# EAGLE design untitled (EAGLE 6.2)
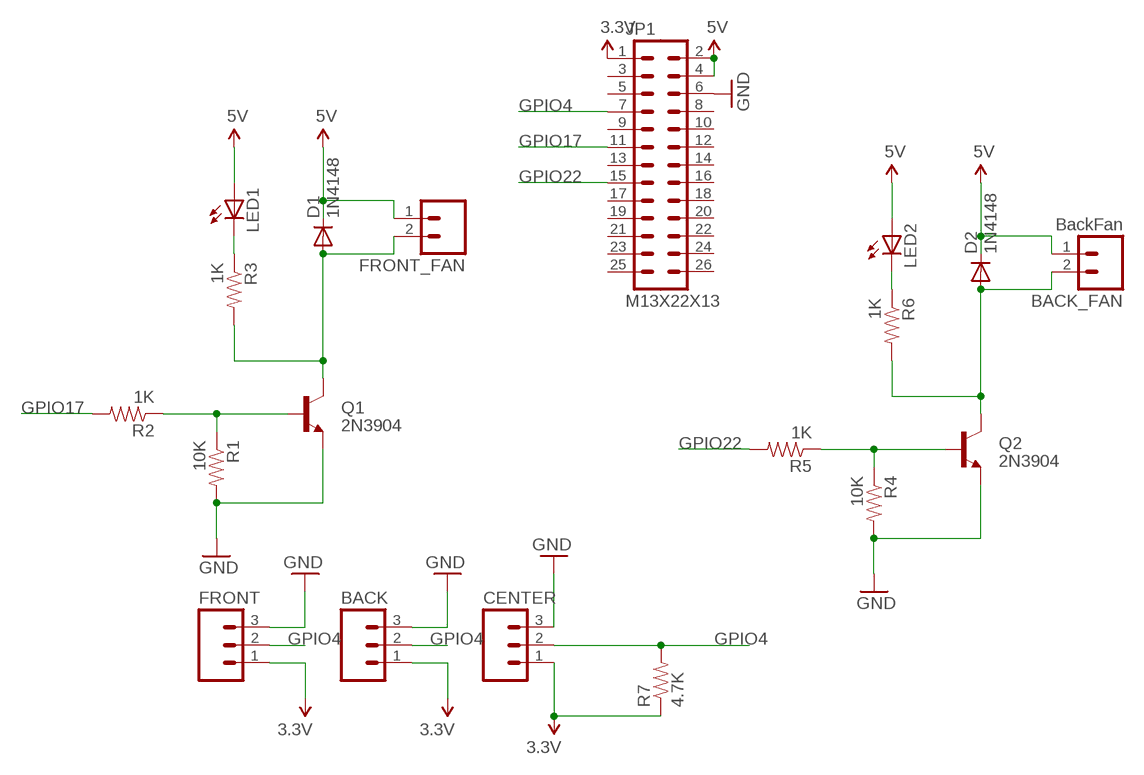
[diagram p0: schematic, sheet 1]

## Parts
BACK  M03LOCK_LONGPADS  [1X03_LOCK_LONGPADS]
BACK_FAN  BackFan  M02LOCK_LONGPADS  [1X02_LOCK_LONGPADS]
CENTER  M03LOCK_LONGPADS  [1X03_LOCK_LONGPADS]
D1  1N4148  DIODE1N4148  [DIODE-1N4148]
D2  1N4148  DIODE1N4148  [DIODE-1N4148]
FRONT  M03LOCK_LONGPADS  [1X03_LOCK_LONGPADS]
FRONT_FAN  M02LOCK_LONGPADS  [1X02_LOCK_LONGPADS]
JP1  M13X22X13  [2X13]
LED1  LED5MM  [LED5MM]
LED2  LED5MM  [LED5MM]
Q1  2N3904  TRANSISTOR_NPNTO92  [TO-92]
Q2  2N3904  TRANSISTOR_NPNTO92  [TO-92]
R1  10K  RESISTOR0805-RES  [0805]
R2  1K  RESISTOR0805-RES  [0805]
R3  1K  RESISTOR0805-RES  [0805]
R4  10K  RESISTOR0805-RES  [0805]
R5  1K  RESISTOR0805-RES  [0805]
R6  1K  RESISTOR0805-RES  [0805]
R7  4.7K  RESISTOR0805-RES  [0805]

## Nets
3.3V: BACK.1 CENTER.1 FRONT.1 JP1.1 R7.1
5V: BACK_FAN.1 D1.C D2.C FRONT_FAN.1 JP1.2 JP1.4 LED1.A LED2.A
GND: BACK.3 CENTER.3 FRONT.3 JP1.6 Q1.1(E) Q2.1(E) R1.2 R4.2
GPIO4: BACK.2 CENTER.2 FRONT.2 JP1.7 R7.2
GPIO17: JP1.11 R2.2
GPIO22: JP1.15 R5.2
N$1: LED1.K(C) R3.1
N$2: Q1.2(B) R1.1 R2.1
N$3: D1.A FRONT_FAN.2 Q1.3(C) R3.2
N$7: LED2.K(C) R6.1
N$8: Q2.2(B) R4.1 R5.1
N$9: BACK_FAN.2 D2.A Q2.3(C) R6.2
Unconnected: JP1.3 JP1.5 JP1.8 JP1.9 JP1.10 JP1.12 JP1.13 JP1.14 JP1.16 JP1.17 JP1.18 JP1.19 JP1.20 JP1.21 JP1.22 JP1.23 JP1.24 JP1.25 JP1.26

## Library data of the parts
BACK CENTER FRONT = SparkFun-Connectors:M03: Header 3 Standard 3-pin 0.1" header. Use with straight break away headers (SKU : PRT-00116), right angle break away headers (PRT-00553), swiss pins (PRT-00743), machine pins (PRT-00117), and female headers (PRT-00115). Molex polarized connector foot print use with SKU : PRT-08232 with associated crimp pins and housings.
BACK_FAN FRONT_FAN = SparkFun-Connectors:M02: Header 2 Standard 2-pin 0.1" header. Use with straight break away headers (SKU : PRT-00116), right angle break away headers (PRT-00553), swiss pins (PRT-00743), machine pins (PRT-00117), and female headers (PRT-00115). Molex polarized connector foot print use with SKU : PRT-08233 with associated crimp pins and housings.
D1 D2 = SparkFun-DiscreteSemi:DIODE: Diode These are standard reverse protection diodes and small signal diodes. SMA package can handle up to about 1A. SOD-323 can handle about 200mA. What the SOD-323 package when ordering, there are some mfgs out there that are 5-pin packages.
JP1 = SparkFun-Connectors:M13X2: 0.1" spaced headers
LED1 LED2 = SparkFun-LED:LED: LEDs Standard schematic elements and footprints for 5mm, 3mm, 1206, and 0603 sized LEDs. 5mm - Spark Fun Electronics SKU : COM-00529 (and others)
Q1 Q2 = SparkFun-DiscreteSemi:TRANSISTOR_NPN: Generic NPN BJT. MMBT2222 is the common NPN we use. Double check against datasheet- not all devices are the same!
R1-R7 = SparkFun-Resistors:RESISTOR: Resistor Basic schematic elements and footprints for 0603, 1206, and PTH resistors.

## Board
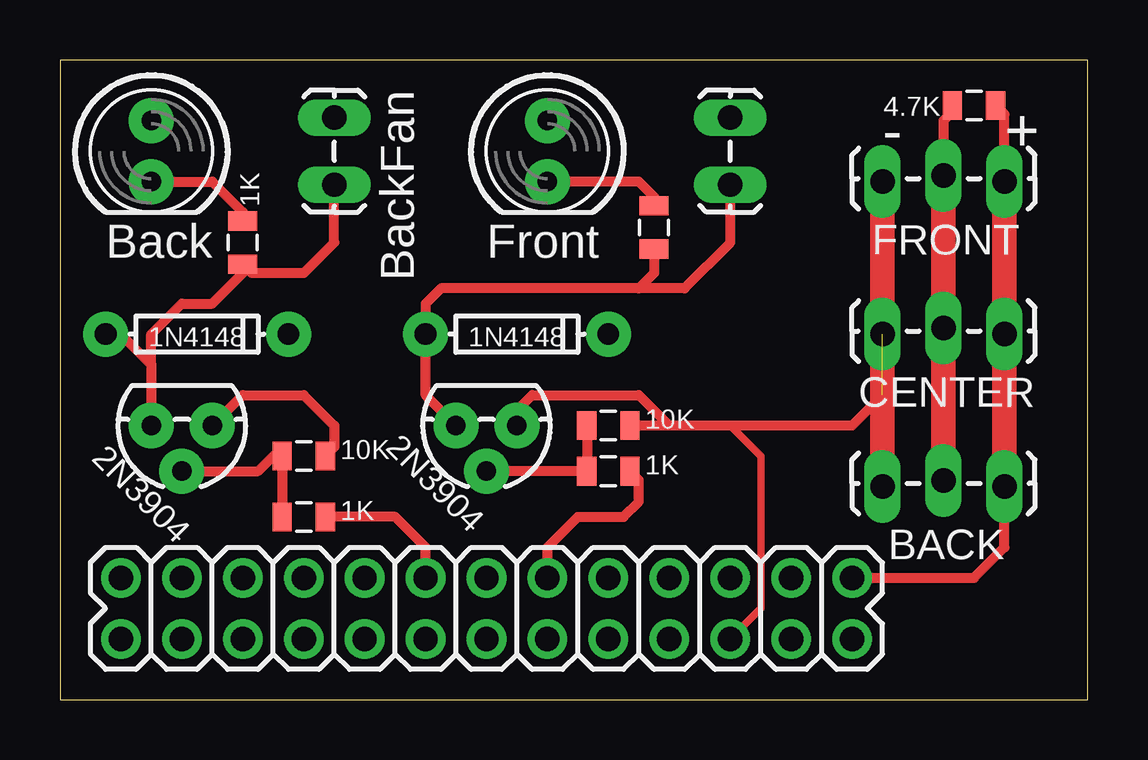
[diagram p1: board, top side]
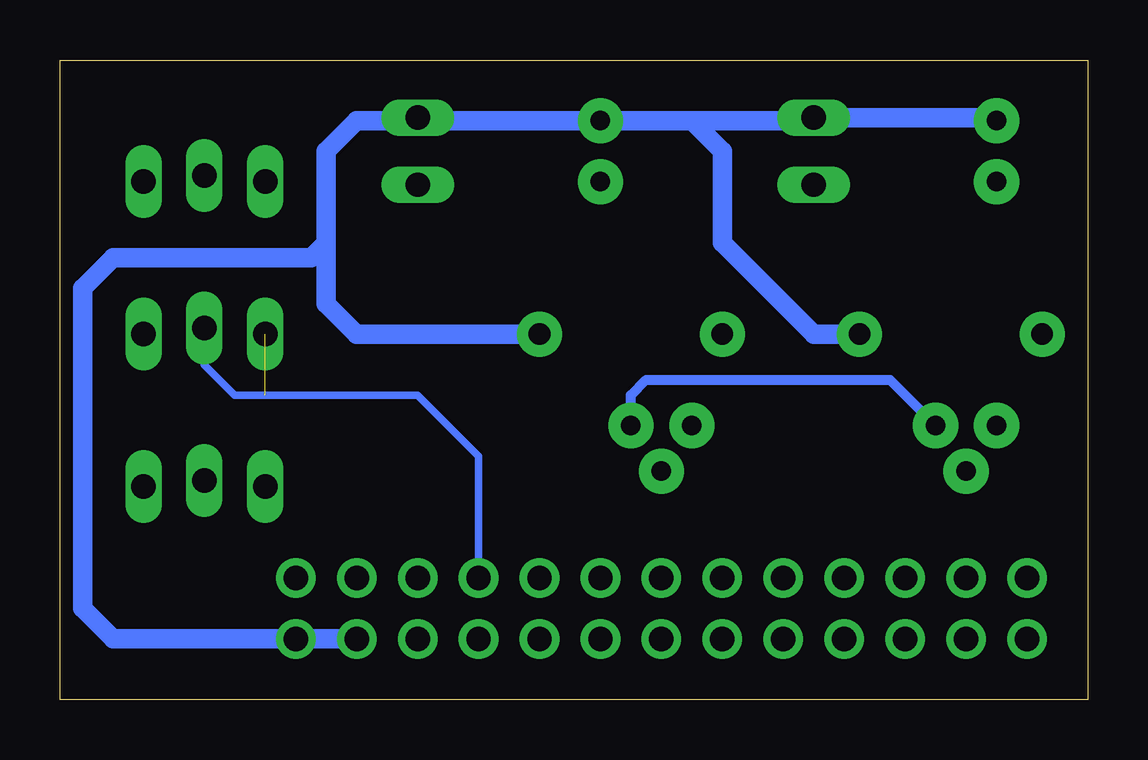
[diagram p2: board, bottom side, seen from below]

Size 42.85 x 26.66 mm. Coordinates in mm from the lower left corner, seen from the top.
Outline: 0,0 42.85,0 42.85,26.66 0,26.66 0,0
Copper layers (1*16): Top 0.0356mm / dielectric 1.5011mm / Bottom 0.0356mm
Design rules "default": minimum track width 6mil, minimum drill 13mil, track to track 6mil, track to pad 6mil, pad to pad 6mil, via to via 6mil, smd to smd 6mil, copper to edge 15mil, drill to drill 6mil, minimum pad ring 7mil, minimum via ring 7mil, stop-mask expansion 4mil, vias tented up to drill 0mil, thermal gap 10mil

### Footprints (pad centres in the part's own frame; a part is rotated, then mirrored left to right if it is on the bottom)
1X03_LOCK_LONGPADS = drill 1.016 long: 1 0,0; 2 2.54,-0.254; 3 5.08,0
1X02_LOCK_LONGPADS = drill 1.016 long: 1 -0.127,0; 2 2.667,0
DIODE-1N4148 = drill 0.9 pad 1.88: A -3.81,0; C 3.81,0
2X13 = drill 1.016 pad 1.651: 1 0,0; 2 0,2.54; 3 2.54,0; 4 2.54,2.54; 5 5.08,0; 6 5.08,2.54; 7 7.62,0; 8 7.62,2.54; 9 10.16,0; 10 10.16,2.54; 11 12.7,0; 12 12.7,2.54; 13 15.24,0; 14 15.24,2.54; 15 17.78,0; 16 17.78,2.54; 17 20.32,0; 18 20.32,2.54; 19 22.86,0; 20 22.86,2.54; 21 25.4,0; 22 25.4,2.54; 23 27.94,0; 24 27.94,2.54; 25 30.48,0; 26 30.48,2.54
LED5MM = drill 0.813 pad 1.88: A -1.27,0; K 1.27,0
TO-92 = drill 0.813 pad 1.88: 1 -1.27,0; 2 0,1.905; 3 1.27,0
0805 = smd 0.8 x 1.2: 1 -0.9,0; 2 0.9,0

### Placement (x,y rotation side)
BACK  39.37,15.24 180 top
BACK_FAN  11.43,24.13 270 top
CENTER  39.37,21.59 180 top
D1  19.05,15.24 0 top
D2  5.71,15.24 0 top
FRONT  39.37,8.89 180 top
FRONT_FAN  27.94,24.13 270 top
JP1  33.02,5.08 180 top
LED1  20.32,22.86 270 top
LED2  3.81,22.86 270 top
Q1  17.78,11.43 180 top
Q2  5.08,11.43 180 top
R1  22.86,11.43 0 top
R2  22.86,9.53 0 top
R3  24.77,19.68 270 top
R4  10.16,10.16 0 top
R5  10.16,7.62 0 top
R6  7.62,19.05 270 top
R7  38.1,24.77 180 top

### Tracks (layer width: path | path; a pad name or v marks a point on that pad's centre or on a via)
3.3V
  Top 0.406: JP1.1 38.1,5.08 39.37,6.35 FRONT.1 | CENTER.1 39.37,24.39 R7.1
  Top 1.016: FRONT.1 BACK.1 CENTER.1
5V
  Bottom 0.813: 16.51,24.13 LED1.A 27.81,24.13 FRONT_FAN.1 28.07,24.13 30.48,24.13 31.75,22.86 31.75,19.05 | 16.51,24.13 11.56,24.13 BACK_FAN.1 3.94,24.26 LED2.A | D2.C 11.43,15.24 15.24,19.05 15.24,22.86 16.51,24.13 | D1.C 30.48,15.24 31.75,16.51 31.75,19.05 | JP1.2 JP1.4 40.64,2.54 41.91,3.81 41.91,17.14 40.64,18.41 32.38,18.41 31.75,19.05
GND  (1 unrouted)
  Top 0.305: JP1.6 29.21,3.81 29.21,10.16 27.94,11.43
  Top 0.406: Q2.1 7.62,12.7 10.16,12.7 11.43,11.43 11.43,10.53 R4.2 | 34.29,12.7 33.02,11.43 27.94,11.43 25.4,11.43 | 25.4,11.43 R1.2 | Q1.1 19.05,12.06 19.68,12.7 24.13,12.7 25.4,11.43
  Top 1.016: CENTER.3 BACK.3 FRONT.3
  Bottom 0.406: Q1.1 19.05,12.7 18.41,13.34 8.26,13.34 Q2.1
GPIO4
  Top 0.406: R7.2 37.2,24.5 36.83,24.13 CENTER.2
  Top 1.016: CENTER.2 BACK.2 FRONT.2
  Bottom 0.305: JP1.7 25.4,10.16 27.94,12.7 35.56,12.7 36.83,13.97 BACK.2
GPIO17
  Top 0.406: JP1.11 20.32,6.35 21.59,7.62 23.5,7.62 24.13,8.26 24.13,9.15 R2.2
GPIO22
  Top 0.406: JP1.15 15.24,6.35 13.97,7.62 R5.2
N$1
  Top 0.406: R3.1 24.77,20.95 24.13,21.59 LED1.K
N$2
  Top 0.406: Q1.2 R2.1 R1.1
N$3
  Top 0.406: 24.13,17.14 26.04,17.14 27.94,19.05 FRONT_FAN.2 | 24.13,17.14 15.88,17.14 15.24,16.51 D1.A 15.24,12.7 Q1.3 | R3.2 24.77,17.78 24.13,17.14
N$7
  Top 0.406: LED2.K 6.35,21.59 7.62,20.32 R6.1
N$8
  Top 0.406: Q2.2 8.26,9.53 8.89,10.16 R4.1 R5.1
N$9
  Top 0.406: D2.A 2.54,15.24 3.81,13.97 | 3.81,13.97 Q2.3 | 3.81,13.97 3.81,15.24 5.08,16.51 6.35,16.51 7.62,17.78 R6.2 7.99,17.78 10.16,17.78 11.43,19.05 BACK_FAN.2

### Text on the board
tNames: BackFan | - | + | Back | Front
tValues: FrontFan